# EAGLE schematic Control_Unit (EAGLE 9.6.2)
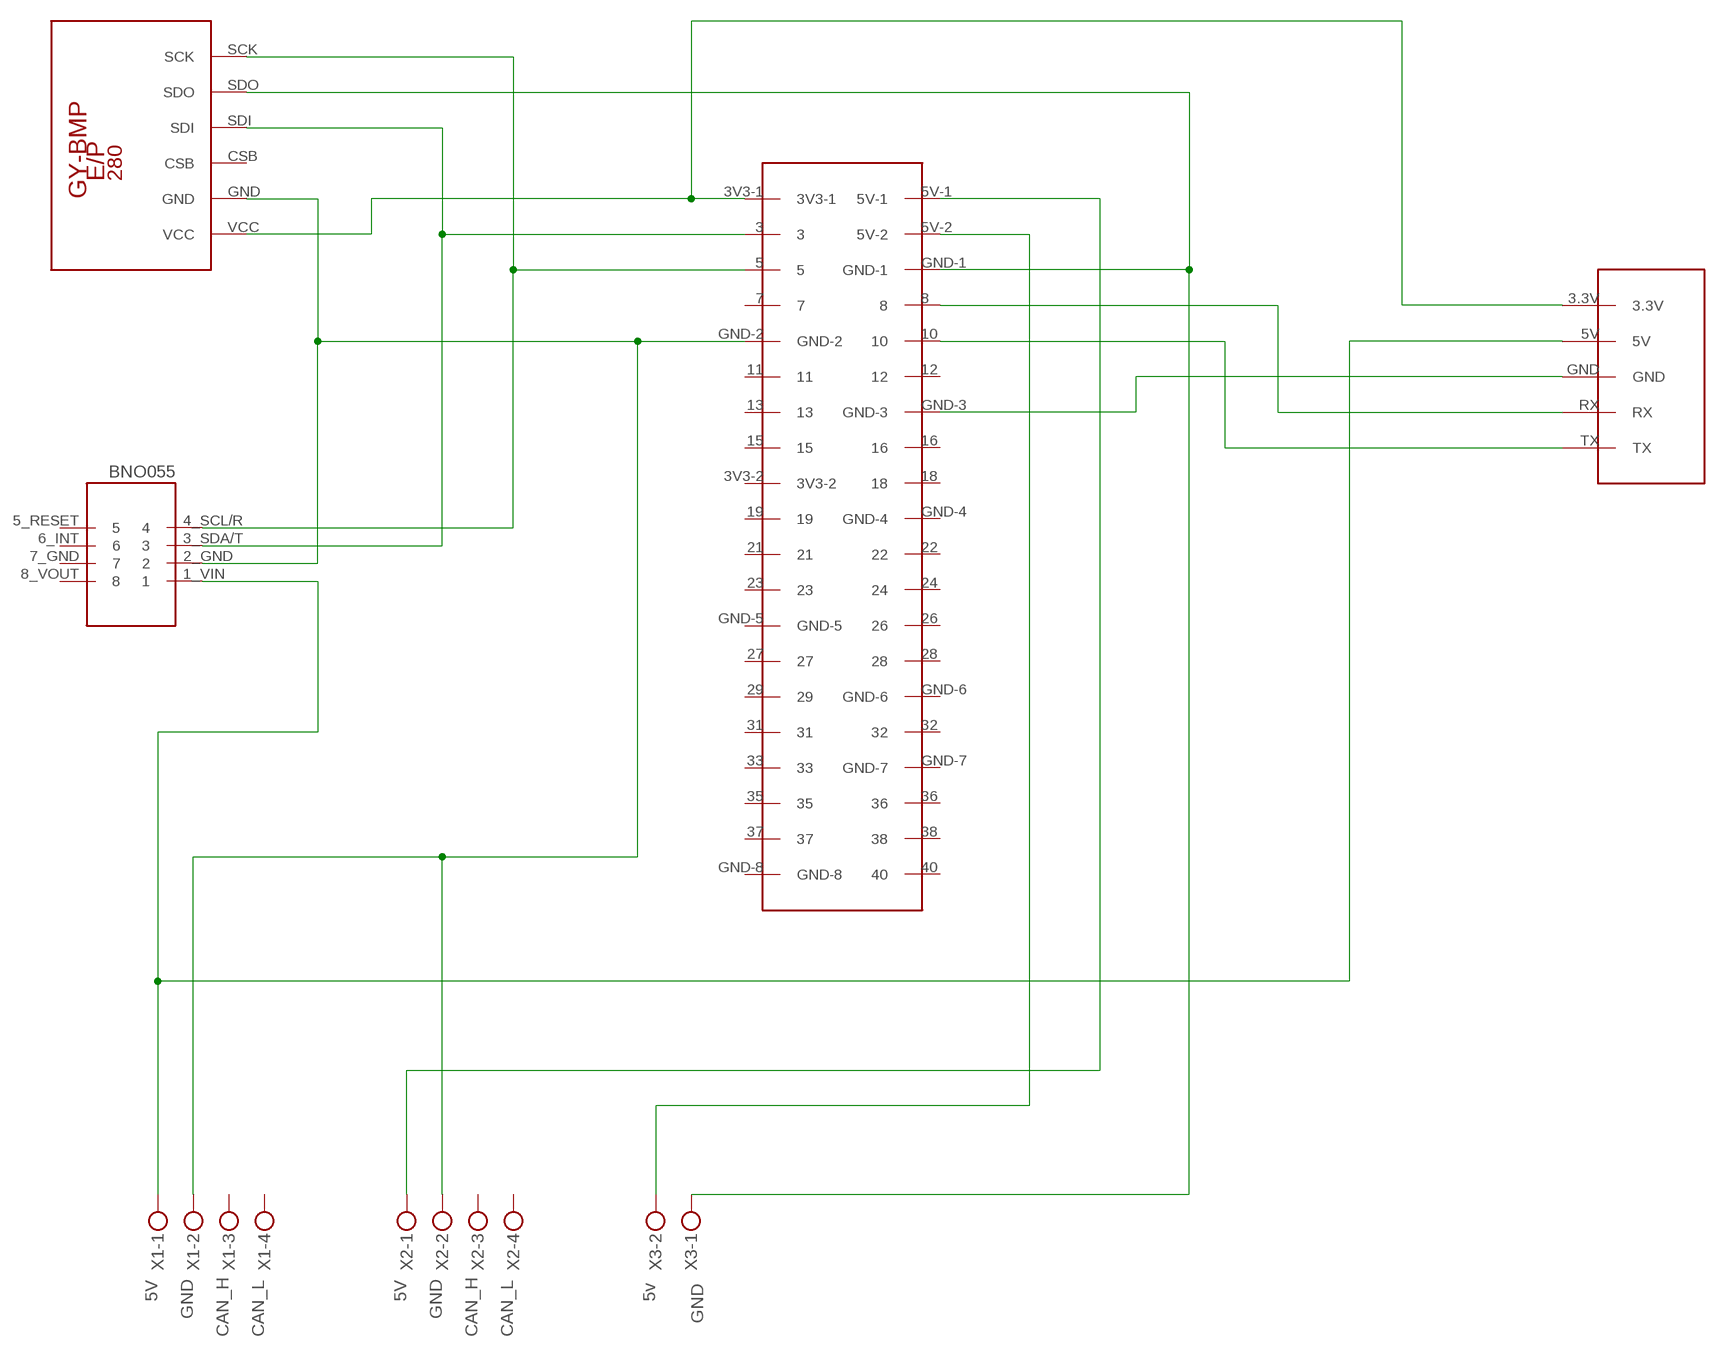
[diagram p0: schematic, sheet 1]

## Parts
JN1  JETSON_NANO  [JETSON_NANO]
U$1  GY-BPM280  [GY-BMP280-FOOTPRINT]
U$2  BNO055  [BNO055]
U$3  WIRELESS_PINS  [WIRELESS_PINS]
X1  MKDSN1,5/4-5,08  [MKDSN1,5/4-5,08]
X2  MKDSN1,5/4-5,08  [MKDSN1,5/4-5,08]
X3  MKDSN1,5/2-5,08  [MKDSN1,5/2-5,08]

## Nets
N$1: JN1.3V3-1 U$1.VCC U$3.3.3V
N$2: JN1.GND-2 U$1.GND U$2.2_GND X1.2 X2.2
N$3: JN1.GND-1 U$1.SDO X3.1
N$4: JN1.3 U$1.SDI U$2.3_SDA/T
N$5: JN1.5 U$1.SCK U$2.4_SCL/R
N$6: U$2.1_VIN U$3.5V X1.1
N$7: JN1.GND-3 U$3.GND
N$8 [PW]: JN1.5V-1 X2.1
N$9: JN1.8 U$3.RX
N$10: JN1.10 U$3.TX
N$11 [PW]: JN1.5V-2 X3.2
Unconnected: JN1.3V3-2 JN1.7 JN1.11 JN1.12 JN1.13 JN1.15 JN1.16 JN1.18 JN1.19 JN1.21 JN1.22 JN1.23 JN1.24 JN1.26 JN1.27 JN1.28 JN1.29 JN1.31 JN1.32 JN1.33 JN1.35 JN1.36 JN1.37 JN1.38 JN1.40 JN1.GND-4 JN1.GND-5 JN1.GND-6 JN1.GND-7 JN1.GND-8 U$1.CSB U$2.5_RESET U$2.6_INT U$2.7_GND U$2.8_VOUT X1.3 X1.4 X2.3 X2.4

## Notes on the sheet
- GND
- 5V | 5V | 5v
- GND | GND
- CAN_H | CAN_L | CAN_H | CAN_L

## Library data of the parts
JN1 = Jetson_Nano_GPIO:JETSON_NANO: Jetson Nano GPIO
U$1 = BMP280:GY-BPM280
U$2 = BNO055:BNO055
U$3 = Wireless_Pins:WIRELESS_PINS
X1 X2 = con-phoenix-508:MKDSN1,5/4-5,08: MKDSN 1,5/ 4-5,08 Printklemme Nennstrom: 13,5 A Nennspannung: 250 V Rastermaß: 5,08 mm Polzahl: 4 Anschlussart: Schraubanschluss Montage: Löten Anschlussrichtung Leiter/Platine: 0 ° Artikelnummer: 1729144 Source: http://eshop.phoenixcontact.com .. 1729144.pdf
X3 = con-phoenix-508:MKDSN1,5/2-5,08: MKDSN 1,5/ 2-5,08 Printklemme Nennstrom: 13,5 A Nennspannung: 250 V Rastermaß: 5,08 mm Polzahl: 2 Anschlussart: Schraubanschluss Montage: Löten Anschlussrichtung Leiter/Platine: 0 ° Artikelnummer: 1729128 Source: http://eshop.phoenixcontact.com .. 1729128.pdf

## Net classes
0 default: width 0.762 mm, clearance 0.381 mm
1 PW: width 1.778 mm, clearance 1.016 mm